# Altium schematic sheet Sensor_Glove_Main-X01.SchDoc: MCU + BLE
size Letter; Author: C. DEMOLDER; CompanyName: GTBID; DrawnBy: C. DEMOLDER; Engineer: C. DEMOLDER; Organization: GEORGIA TECH; Address1: NORTH AVE NW; Address2: ATLANTA, GA, 30332; DocumentNumber: P001; Revision: X01; SheetNumber: 1; SheetTotal: 4
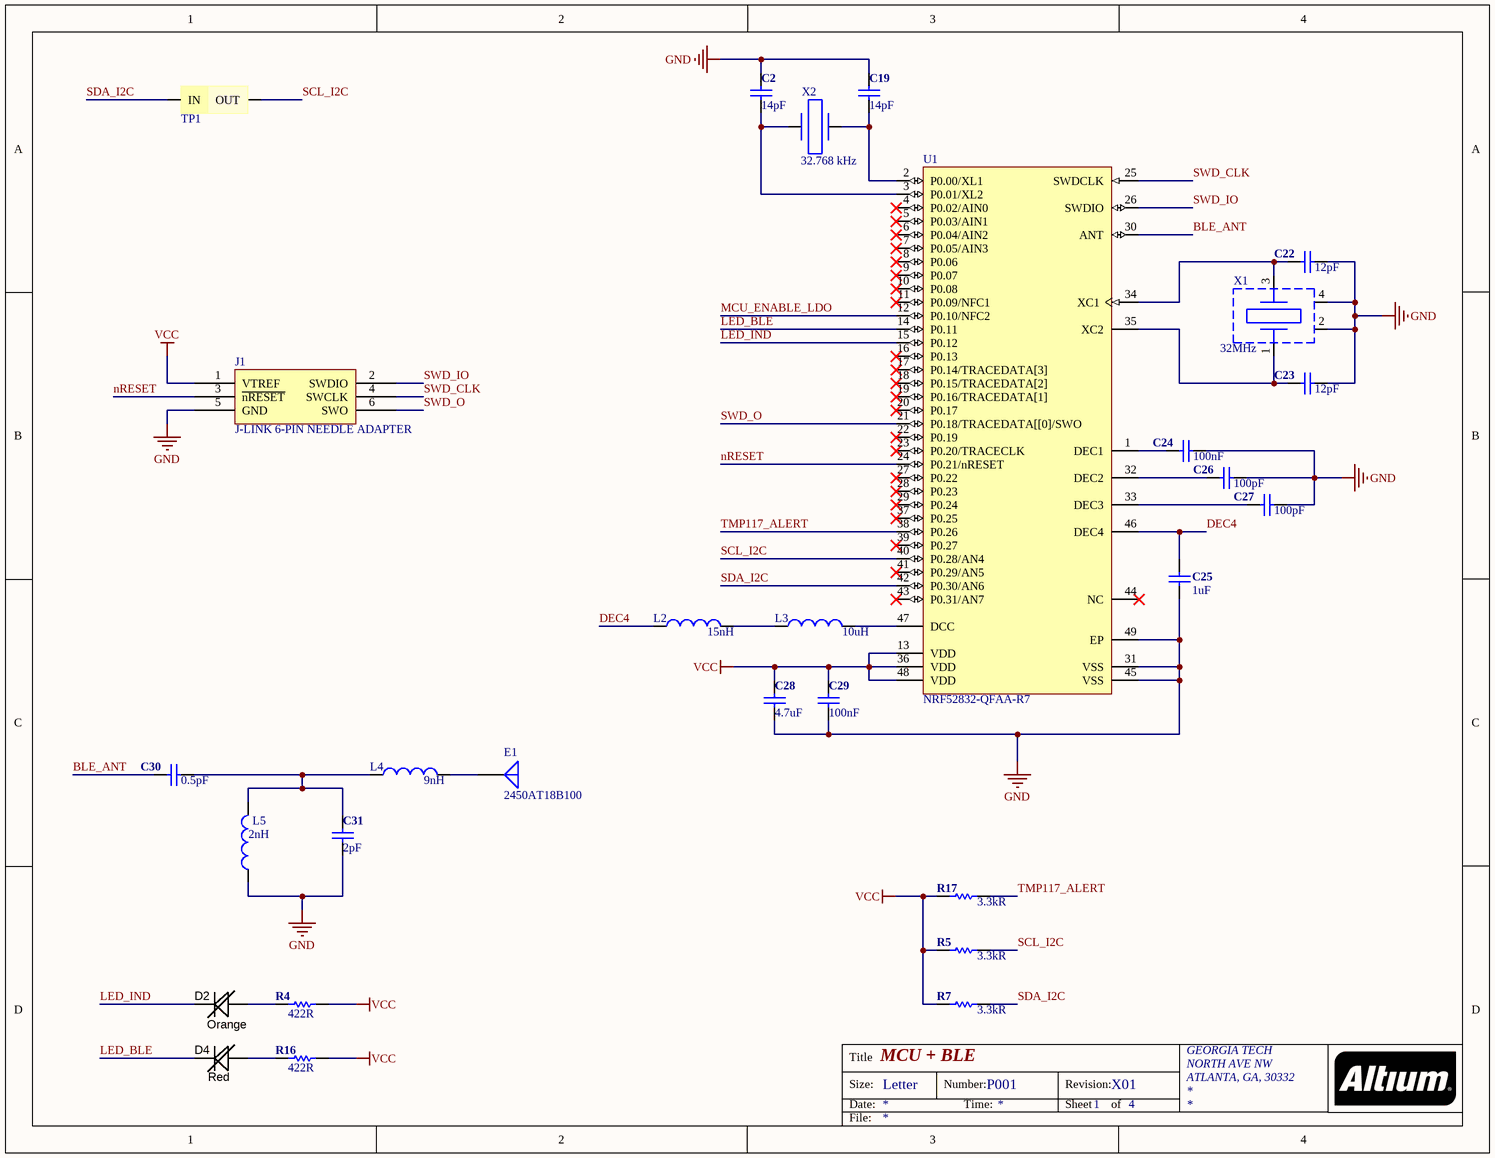
[diagram p0: Sensor_Glove_Main-X01.SchDoc]

## Parts
C2  14pF  [C0402]
C19  14pF  [C0402]
C22  12pF  [C0402]
C23  12pF  [C0402]
C24  100nF  [C0402]
C25  1uF  [C0402]
C26  100pF  [C0402]
C27  100pF  [C0402]
C28  4.7uF  [C0402]
C29  100nF  [C0402]
C30  0.5pF  [C0402]
C31  2pF  [C0402]
D2  Orange  [LED_0402]
D4  Red  [LED_0402]
E1  2450AT18B100  [2450AT18B100]
J1  J-LINK 6-PIN NEEDLE ADAPTER  [J-LINK 6 PIN NEEDLE]
L2  15nH  [L0402]
L3  10uH  [L0603]
L4  9nH  [L0402]
L5  2nH  [L0402]
R4  422R  [R0402]
R5  3.3kR  [R0402]
R7  3.3kR  [R0402]
R16  422R  [R0402]
R17  3.3kR  [R0402]
TP1  JUMPER  [JUMPER]  (value not drawn)
U1  NRF52832-QFAA-R7  [NRF52832-QFAA-R7]
X1  32MHz  [CRYSTAL_1MM6_X_1MM2]
X2  32.768 kHz  [CRYSTAL_1MM2_X_1MM0]

## Nets
GND: C2.1 C19.1 C22.2 C23.2 C24.2 C25.1 C26.2 C27.2 C28.2 C29.1 C31.2 J1.5(GND) L5.1 U1.31(VSS) U1.45(VSS) U1.49(EP) X1.2(GND) X1.4(GND)
VCC: C28.1 C29.2 J1.1(VTREF) R4.1 R5.1 R7.1 R16.1 R17.1 U1.13(VDD) U1.36(VDD) U1.48(VDD)
BLE_ANT: C30.1 U1.30(ANT)
DEC4: C25.2 L2.1 U1.46(DEC4)
LED_BLE: D4.K U1.14(P0.11)
LED_IND: D2.K U1.15(P0.12)
MCU_ENABLE_LDO: U1.12(P0.10/NFC2)
nRESET: J1.3(~{nRESET}) U1.24(P0.21/nRESET)
SCL_I2C: R5.2 TP1.2(OUT) U1.40(P0.28/AN4)
SDA_I2C: R7.2 TP1.1(IN) U1.42(P0.30/AN6)
SWD_CLK: J1.4(SWCLK) U1.25(SWDCLK)
SWD_IO: J1.2(SWDIO) U1.26(SWDIO)
SWD_O: J1.6(SWO) U1.21(P0.18/TRACEDATA[[0]/SWO)
TMP117_ALERT: R17.2 U1.38(P0.26)
NetC2_2: C2.2 U1.3(P0.01/XL2) X2.1
NetC19_2: C19.2 U1.2(P0.00/XL1) X2.2
NetC22_1: C22.1 U1.34(XC1) X1.3
NetC23_1: C23.1 U1.35(XC2) X1.1
NetC24_1: C24.1 U1.1(DEC1)
NetC26_1: C26.1 U1.32(DEC2)
NetC27_1: C27.1 U1.33(DEC3)
NetC30_2: C30.2 C31.1 L4.1 L5.2
NetD2_A: D2.A R4.2
NetD4_A: D4.A R16.2
NetE1_1: E1.1(A) L4.2
NetL2_2: L2.2 L3.1
NetL3_2: L3.2 U1.47(DCC)

Not connected (* = marked no-connect by the designer): U1 4(P0.02/AIN0)* 5(P0.03/AIN1)* 6(P0.04/AIN2)* 7(P0.05/AIN3)* 8(P0.06)* 9(P0.07)* 10(P0.08)* 11(P0.09/NFC1)* 16(P0.13)* 17(P0.14/TRACEDATA[3])* 18(P0.15/TRACEDATA[2])* 19(P0.16/TRACEDATA[1])* 20(P0.17)* 22(P0.19)* 23(P0.20/TRACECLK)* 27(P0.22)* 28(P0.23)* 29(P0.24)* 37(P0.25)* 39(P0.27)* 41(P0.29/AN5)* 43(P0.31/AN7)* 44(NC)*

## Notes on the sheet
- Title
- Size:
- Date:
- Letter
- Number:
- Time:
- Revision:
- Sheet
- of
- File:

## Library data of the parts
C2 C19 = C-0402(1005): Ceramic Capacitor, Multilayer, Ceramic, 50V, 1% +Tol, 1% -Tol, C0G, 30ppm/Cel TC, 0.000014uF, Surface Mount, 0402; Manufacturer: Kyocera AVX; Manufacturer Part Number: 04025U140FAT2A; ComponentLink1URL: https://datasheet.ciiva.com/169/product-169683.pdf; ComponentLink1Description: https://datasheet.ciiva.com/169/product-169683.pdf; Supplier 1: Digi-Key; Supplier Part Number 1: 478-10139-1-ND; RoHS: Yes; Category: Ceramic Capacitors; Stock 1: 25036; Pricing 1: 1=0.35000, 10=0.24100, 100=0.14460, 500=0.10846, 1000=0.09158, 2500=0.08676, 5000=0.08194 (USD); Mount: Surface Mount; Case/Package: 0402; Case Code (Imperial): 0402; Case Code (Metric): 1005; Min Operating Temperature: -55°C; Max Operating Temperature: 125°C; Dielectric: C0G; Capacitance: 14pF; Package Quantity: 10000; Voltage Rating: 50V; Voltage Rating (DC): 50V; Tolerance: 1%; Packaging: Tape and Reel; Termination: SMD/SMT; Composition: Ceramic; Length: 1mm; Width: 0.5mm; Thickness: 0.022inch; Depth: 0.5mm; Radiation Hardening: No; ComponentLink2URL: https://datasheet.ciiva.com:443/pdfs/VipMasterIC/IC/AVXC/AVXC-S-A0001948465/AVXC-S-A0001948465-1.pdf?src-supplier=IHS+Markit; ComponentLink2Description: https://datasheet.ciiva.com:443/pdfs/VipMasterIC/IC/AVXC/AVXC-S-A0001948465/AVXC-S-A0001948465-1.pdf?src-supplier=IHS+Markit; ComponentLink3URL: https://datasheet.ciiva.com/6269/useries-6269558.pdf?src-supplier=Digi-Key; ComponentLink3Description: https://datasheet.ciiva.com/6269/useries-6269558.pdf?src-supplier=Digi-Key; ComponentLink4URL: https://datasheet.ciiva.com/11568/useries-11568551.pdf?src-supplier=Avnet; ComponentLink4Description: https://datasheet.ciiva.com/11568/useries-11568551.pdf?src-supplier=Avnet
C22 C23 = C-0402(1005): Ceramic Capacitor, Multilayer, Ceramic, 50V, 1% +Tol, 1% -Tol, C0G, 30ppm/Cel TC, 0.000012uF, Surface Mount, 0402; Manufacturer: Kyocera AVX; Manufacturer Part Number: 04025U120FAT2A; ComponentLink1URL: https://datasheet.ciiva.com/169/product-169683.pdf; ComponentLink1Description: https://datasheet.ciiva.com/169/product-169683.pdf; Supplier 1: Digi-Key; Supplier Part Number 1: 478-10136-1-ND; RoHS: Yes; Category: Ceramic Capacitors; Stock 1: 30880; Pricing 1: 1=0.33000, 10=0.22700, 100=0.13630, 500=0.10220, 1000=0.08630, 2500=0.08176, 5000=0.07721 (USD); Mount: Surface Mount; Case/Package: 0402; Weight: 2.3E-05oz; Case Code (Metric): 1005; Case Code (Imperial): 0402; Min Operating Temperature: -55°C; Max Operating Temperature: 125°C; Termination: SMD/SMT; Composition: Ceramic; Tolerance: 1%; Packaging: Tape and Reel; Package Quantity: 10000; Capacitance: 12pF; Voltage Rating: 50V; Voltage Rating (DC): 50V; Dielectric: C0G; Length: 1mm; Height: 0.02mm; Thickness: 0.022inch; Depth: 0.5mm; Width: 0.02inch; Radiation Hardening: No; Lead Free: Lead Free; ComponentLink2URL: https://datasheet.ciiva.com:443/pdfs/VipMasterIC/IC/AVXC/AVXC-S-A0008668660/AVXC-S-A0008668660-1.pdf?src-supplier=IHS+Markit; ComponentLink2Description: https://datasheet.ciiva.com:443/pdfs/VipMasterIC/IC/AVXC/AVXC-S-A0008668660/AVXC-S-A0008668660-1.pdf?src-supplier=IHS+Markit; ComponentLink3URL: https://datasheet.ciiva.com/16327/useries-16327642.pdf?src-supplier=Future+Electronics; ComponentLink3Description: https://datasheet.ciiva.com/16327/useries-16327642.pdf?src-supplier=Future+Electronics; ComponentLink4URL: https://datasheet.ciiva.com/11568/useries-11568940.pdf?src-supplier=Avnet; ComponentLink4Description: https://datasheet.ciiva.com/11568/useries-11568940.pdf?src-supplier=Avnet
C24 C29 = C-0402(1005): Ceramic Capacitor, Multilayer, Ceramic, 25V, 10% +Tol, 10% -Tol, X5R, 15% TC, 0.1uF, Surface Mount, 0402; Manufacturer: Taiyo Yuden; Manufacturer Part Number: TMK105BJ104KV-F; ComponentLink1URL: https://datasheet.ciiva.com/169/product-169683.pdf; ComponentLink1Description: https://datasheet.ciiva.com/169/product-169683.pdf; Supplier 1: Digi-Key; Supplier Part Number 1: 587-1456-1-ND; RoHS: Yes; Category: Ceramic Capacitors; Mount: Surface Mount; Case/Package: 0402; Number of Pins: 2; Weight: 2.3E-05oz; Case Code (Imperial): 0402; Case Code (Metric): 1005; Min Operating Temperature: -55°C; Max Operating Temperature: 85°C; Capacitance: 100nF; Tolerance: 10%; Packaging: Tape and Reel; Dielectric: X5R; Voltage Rating (DC): 25V; Voltage Rating: 25V; Package Quantity: 1; Termination: SMD/SMT; Voltage: 25V; Length: 1mm; Height: 0.5mm; Width: 0.5mm; Depth: 0.5mm; Thickness: 0.022inch; REACH SVHC: No SVHC; Lead Free: Lead Free; Halogen Free: Halogen Free; ComponentLink2URL: https://datasheet.ciiva.com:443/pdfs/VipMasterIC/IC/TAIY/TAIY-S-A0009103435/TAIY-S-A0009103038-1.pdf?src-supplier=IHS+Markit; ComponentLink2Description: https://datasheet.ciiva.com:443/pdfs/VipMasterIC/IC/TAIY/TAIY-S-A0009103435/TAIY-S-A0009103038-1.pdf?src-supplier=IHS+Markit; ComponentLink3URL: https://datasheet.ciiva.com/30051/25tmk105bj104kv-f-30051094.pdf?src-supplier=Onlinecomponents.com; ComponentLink3Description: https://datasheet.ciiva.com/30051/25tmk105bj104kv-f-30051094.pdf?src-supplier=Onlinecomponents.com; ComponentLink4URL: https://datasheet.ciiva.com/15922/28tmk105bj104kv-f-15922315.pdf?src-supplier=Onlinecomponents.com; ComponentLink4Description: https://datasheet.ciiva.com/15922/28tmk105bj104kv-f-15922315.pdf?src-supplier=Onlinecomponents.com; ComponentLink5URL: https://datasheet.ciiva.com/131/tmk105bj104kv-f-ss-131420.pdf?src-supplier=Digi-Key; ComponentLink5Description: https://datasheet.ciiva.com/131/tmk105bj104kv-f-ss-131420.pdf?src-supplier=Digi-Key; ComponentLink6URL: https://datasheet.ciiva.com/22768/1693457-22768649.pdf?src-supplier=Farnell; ComponentLink6Description: https://datasheet.ciiva.com/22768/1693457-22768649.pdf?src-supplier=Farnell
  C24: Stock 1: 27456801; Pricing 1: 1=0.10000, 10=0.04600, 100=0.02050, 500=0.01464, 1000=0.01150, 2500=0.01045, 5000=0.00961 (USD); Composition: Ceramic
  C29: Stock 1: 21430567; Pricing 1: 1=0.10000, 10=0.04000, 50=0.02180, 100=0.01780, 500=0.01270, 1000=0.00998, 2500=0.00908, 5000=0.00835 (USD); Resistor Type: Ceramic
C25 = C-0402(1005): Ceramic Capacitor, Multilayer, Ceramic, 6.3V, 20% +Tol, 20% -Tol, X5R, 15% TC, 1uF, Surface Mount, 0402; Manufacturer: Yageo; Manufacturer Part Number: CC0402MRX5R5BB105; Dissipation Factor: 10%; ComponentLink1URL: https://datasheet.ciiva.com/169/product-169683.pdf; ComponentLink1Description: https://datasheet.ciiva.com/169/product-169683.pdf; Supplier 1: Digi-Key; Supplier Part Number 1: 311-1441-1-ND; RoHS: Yes; Category: Ceramic Capacitors; Stock 1: 16697; Pricing 1: 1=0.13000, 10=0.08900, 100=0.04200, 500=0.02946, 1000=0.02439, 2500=0.02270, 5000=0.02076 (USD); Mount: Surface Mount; Case/Package: 0402; Number of Pins: 2; Case Code (Imperial): 0402; Case Code (Metric): 1005; Min Operating Temperature: -55°C; Max Operating Temperature: 85°C; Capacitance: 1uF; Tolerance: 20%; Voltage Rating: 6.3V; Voltage Rating (DC): 6.3V; Packaging: Tape and Reel; Package Quantity: 1; Dielectric: X5R; Termination: SMD/SMT; Composition: Ceramic; Length: 1mm; Height: 0.5mm; Width: 0.5mm; Thickness: 0.022inch; Depth: 0.5mm; Lead Free: Lead Free; Halogen Free: Halogen Free; ComponentLink2URL: https://datasheet.ciiva.com:443/pdfs/VipMasterIC/IC/YAGO/YAGO-S-A0006851646/YAGO-S-A0006851646-1.pdf?src-supplier=IHS+Markit; ComponentLink2Description: https://datasheet.ciiva.com:443/pdfs/VipMasterIC/IC/YAGO/YAGO-S-A0006851646/YAGO-S-A0006851646-1.pdf?src-supplier=IHS+Markit; ComponentLink3URL: https://datasheet.ciiva.com/176/mlccorderingcode-176806.pdf?src-supplier=Digi-Key; ComponentLink3Description: https://datasheet.ciiva.com/176/mlccorderingcode-176806.pdf?src-supplier=Digi-Key; ComponentLink4URL: https://datasheet.ciiva.com/176/mlccorderingcode-176807.pdf?src-supplier=Digi-Key; ComponentLink4Description: https://datasheet.ciiva.com/176/mlccorderingcode-176807.pdf?src-supplier=Digi-Key; ComponentLink5URL: https://datasheet.ciiva.com/176/mlccorderingcode-176808.pdf?src-supplier=Digi-Key; ComponentLink5Description: https://datasheet.ciiva.com/176/mlccorderingcode-176808.pdf?src-supplier=Digi-Key
C26 C27 = C-0402(1005): Ceramic Capacitor, Multilayer, Ceramic, 50V, 1% +Tol, 1% -Tol, C0G, 30ppm/Cel TC, 0.0001uF, Surface Mount, 0402; Manufacturer: Yageo; Manufacturer Part Number: CC0402FRNPO9BN101; ComponentLink1URL: https://datasheet.ciiva.com/169/product-169683.pdf; ComponentLink1Description: https://datasheet.ciiva.com/169/product-169683.pdf; Supplier 1: Digi-Key; Supplier Part Number 1: 311-3329-1-ND; RoHS: Yes; Category: Ceramic Capacitors; Stock 1: 22812; Pricing 1: 1=0.11000, 10=0.08200, 100=0.03840, 500=0.02690, 1000=0.02228, 2500=0.02073, 5000=0.01897 (USD); Mount: Surface Mount; Case/Package: 0402; Case Code (Imperial): 0402; Case Code (Metric): 1005; Min Operating Temperature: -55°C; Max Operating Temperature: 125°C; Package Quantity: 10000; Voltage Rating (DC): 50V; Dielectric: C0G; Termination: SMD/SMT; Composition: Ceramic; Packaging: Tape and Reel; Capacitance: 100pF; Tolerance: 1%; Voltage Rating: 50V; Length: 1mm; Width: 0.02inch; Thickness: 0.022inch; Depth: 0.5mm; Lead Free: Lead Free; ComponentLink2URL: https://datasheet.ciiva.com:443/pdfs/VipMasterIC/IC/YAGO/YAGO-S-A0009251638/YAGO-S-A0009251638-1.pdf?src-supplier=IHS+Markit; ComponentLink2Description: https://datasheet.ciiva.com:443/pdfs/VipMasterIC/IC/YAGO/YAGO-S-A0009251638/YAGO-S-A0009251638-1.pdf?src-supplier=IHS+Markit; ComponentLink3URL: http://www.mouser.com/ds/2/447/Yageo_UPY-GP_NP0_16V-to-50V_9-358835.pdf?src-supplier=Mouser; ComponentLink3Description: http://www.mouser.com/ds/2/447/Yageo_UPY-GP_NP0_16V-to-50V_9-358835.pdf?src-supplier=Mouser; ComponentLink4URL: http://components.arrow.com/part/dataview/0323_00775990?src-supplier=Arrow+Europe; ComponentLink4Description: http://components.arrow.com/part/dataview/0323_00775990?src-supplier=Arrow+Europe; ComponentLink5URL: http://www.yageo.com/NewPortal/yageodocoutput?fileName=/pdf/MLCC/UPY-GP_NP0_16V-to-50V_14.pdf&src-supplier=Digi-Key; ComponentLink5Description: http://www.yageo.com/NewPortal/yageodocoutput?fileName=/pdf/MLCC/UPY-GP_NP0_16V-to-50V_14.pdf&src-supplier=Digi-Key; ComponentLink6URL: http://www.yageo.com/documents/recent/UPY-GP_NP0_16V-to-50V_16.pdf?src-supplier=Digi-Key; ComponentLink6Description: http://www.yageo.com/documents/recent/UPY-GP_NP0_16V-to-50V_16.pdf?src-supplier=Digi-Key; ComponentLink7URL: http://www.yageo.com/documents/recent/UPY-GP_NP0_16V-to-50V_9.pdf?src-supplier=Future+Electronics; ComponentLink7Description: http://www.yageo.com/documents/recent/UPY-GP_NP0_16V-to-50V_9.pdf?src-supplier=Future+Electronics
C28 = C-0402(1005): 0402 10 V 4.7 uF ±20% Tolerance X5R Multilayer Ceramic Chip Capacitor; Manufacturer: Murata; Manufacturer Part Number: GRM155R61A475MEAAD; Voltage Rating: 10V; ComponentLink1URL: https://datasheet.ciiva.com/169/product-169683.pdf; ComponentLink1Description: https://datasheet.ciiva.com/169/product-169683.pdf; Supplier 1: Digi-Key; Supplier Part Number 1: 490-14306-1-ND; Category: Ceramic Capacitors; Stock 1: 420733; Pricing 1: 1=0.25000, 10=0.16900, 100=0.08560, 500=0.05854, 1000=0.05179, 2500=0.04954, 5000=0.04503 (USD); Mount: Surface Mount; Case/Package: 0402; Case Code (Imperial): 0402; Case Code (Metric): 1005; Min Operating Temperature: -55°C; Max Operating Temperature: 85°C; Packaging: Tape and Reel; Capacitance: 4.7uF; Tolerance: 20%; ComponentLink2URL: https://psearch.en.murata.com:443/capacitor/product/GRM155R61A475MEAA%23.pdf?src-supplier=IHS+Markit; ComponentLink2Description: https://psearch.en.murata.com:443/capacitor/product/GRM155R61A475MEAA%23.pdf?src-supplier=IHS+Markit; ComponentLink3URL: http://www.farnell.com/datasheets/2189109.pdf?src-supplier=Farnell; ComponentLink3Description: http://www.farnell.com/datasheets/2189109.pdf?src-supplier=Farnell; ComponentLink4URL: https://search.murata.co.jp/Ceramy/image/img/A01X/G101/ENG/GRM155R61A475MEAA-01.pdf?src-supplier=Digi-Key; ComponentLink4Description: https://search.murata.co.jp/Ceramy/image/img/A01X/G101/ENG/GRM155R61A475MEAA-01.pdf?src-supplier=Digi-Key; ComponentLink5URL: http://www.farnell.com/datasheets/2189109.pdf?src-supplier=Element14; ComponentLink5Description: http://www.farnell.com/datasheets/2189109.pdf?src-supplier=Element14; ComponentLink6URL: http://www.farnell.com/datasheets/2189109.pdf?src-supplier=Newark; ComponentLink6Description: http://www.farnell.com/datasheets/2189109.pdf?src-supplier=Newark; ComponentLink7URL: http://datasheet.octopart.com/GRM155R61A475MEAAD-Murata-datasheet-138740730.pdf?src-supplier=Ciiva+Crawler; ComponentLink7Description: http://datasheet.octopart.com/GRM155R61A475MEAAD-Murata-datasheet-138740730.pdf?src-supplier=Ciiva+Crawler; ComponentLink8URL: http://datasheet.octopart.com/GRM155R61A475MEAAD-Murata-datasheet-140690084.pdf?src-supplier=Ciiva+Crawler; ComponentLink8Description: http://datasheet.octopart.com/GRM155R61A475MEAAD-Murata-datasheet-140690084.pdf?src-supplier=Ciiva+Crawler; ComponentLink9URL: http://datasheet.octopart.com/GRM155R61A475MEAAD-Murata-datasheet-68589269.pdf?src-supplier=Newark; ComponentLink9Description: http://datasheet.octopart.com/GRM155R61A475MEAAD-Murata-datasheet-68589269.pdf?src-supplier=Newark; ComponentLink10URL: http://datasheet.octopart.com/GRM155R61A475MEAAD-Murata-datasheet-8819587.pdf; ComponentLink10Description: http://datasheet.octopart.com/GRM155R61A475MEAAD-Murata-datasheet-8819587.pdf; ComponentLink11URL: http://datasheet.octopart.com/GRM155R61A475MEAAD-Murata-datasheet-10025737.pdf; ComponentLink11Description: http://datasheet.octopart.com/GRM155R61A475MEAAD-Murata-datasheet-10025737.pdf; ComponentLink12URL: http://datasheet.octopart.com/GRM155R61A475MEAAD-Murata-datasheet-11978611.pdf; ComponentLink12Description: http://datasheet.octopart.com/GRM155R61A475MEAAD-Murata-datasheet-11978611.pdf; ComponentLink13URL: http://datasheet.octopart.com/GRM155R61A475MEAAD-Murata-datasheet-12510076.pdf; ComponentLink13Description: http://datasheet.octopart.com/GRM155R61A475MEAAD-Murata-datasheet-12510076.pdf; ComponentLink14URL: http://datasheet.octopart.com/GRM155R61A475MEAAD-Murata-datasheet-12515295.pdf; ComponentLink14Description: http://datasheet.octopart.com/GRM155R61A475MEAAD-Murata-datasheet-12515295.pdf
C30 = C-0402(1005): Ceramic Capacitor, Multilayer, Ceramic, 50V, 10% +Tol, 10% -Tol, C0G, 30ppm/Cel TC, 0.0000005uF, Surface Mount, 0402; Manufacturer: Murata; Manufacturer Part Number: GJM1555C1HR50WB01D; ComponentLink1URL: https://datasheet.ciiva.com/169/product-169683.pdf; ComponentLink1Description: https://datasheet.ciiva.com/169/product-169683.pdf; Supplier 1: Digi-Key; Supplier Part Number 1: 490-11250-1-ND; RoHS: Yes; Category: Ceramic Capacitors; Stock 1: 75988; Pricing 1: 1=0.30000, 10=0.20500, 100=0.11610, 500=0.08198, 1000=0.07173, 2500=0.06831, 5000=0.06319 (USD); Mount: Surface Mount; Case/Package: 0402; Case Code (Metric): 1005; Case Code (Imperial): 0402; Min Operating Temperature: -55°C; Max Operating Temperature: 125°C; Package Quantity: 10000; Capacitance: 0.5pF; Voltage Rating: 50V; Packaging: Tape and Reel; Voltage Rating (DC): 50V; Dielectric: C0G; Termination: SMD/SMT; Voltage: 50V; Length: 1mm; Height: 0.5mm; Width: 0.02inch; Thickness: 0.022inch; Depth: 0.5mm; Radiation Hardening: No; Lead Free: Lead Free; ComponentLink2URL: https://datasheet.ciiva.com:443/pdfs/VipMasterIC/IC/MURE/MURE-S-A0004378008/MURE-S-A0004383131-1.pdf?src-supplier=IHS+Markit; ComponentLink2Description: https://datasheet.ciiva.com:443/pdfs/VipMasterIC/IC/MURE/MURE-S-A0004378008/MURE-S-A0004383131-1.pdf?src-supplier=IHS+Markit; ComponentLink3URL: https://datasheet.ciiva.com/169/product-169683.pdf?src-supplier=Digi-Key; ComponentLink3Description: https://datasheet.ciiva.com/169/product-169683.pdf?src-supplier=Digi-Key
C31 = C-0402(1005): Ceramic Capacitor, Multilayer, Ceramic, 50V, 5% +Tol, 5% -Tol, C0G, 30ppm/Cel TC, 0.000002uF, Surface Mount, 0402; Manufacturer: Murata; Manufacturer Part Number: GJM1555C1H2R0BB01D; ComponentLink1URL: https://datasheet.ciiva.com/169/product-169683.pdf; ComponentLink1Description: https://datasheet.ciiva.com/169/product-169683.pdf; Supplier 1: Digi-Key; Supplier Part Number 1: 490-8091-1-ND; RoHS: Yes; Category: Ceramic Capacitors; Stock 1: 969; Pricing 1: 1=0.19000, 10=0.13000, 100=0.06590, 500=0.04508, 1000=0.03987, 2500=0.03814, 5000=0.03467 (USD); Mount: Surface Mount; Case/Package: 0402; Number of Pins: 2; Case Code (Metric): 1005; Case Code (Imperial): 0402; Min Operating Temperature: -55°C; Max Operating Temperature: 125°C; Package Quantity: 1; Packaging: Tape and Reel; Capacitance: 2pF; Voltage Rating: 50V; Voltage Rating (DC): 50V; Dielectric: C0G; Termination: SMD/SMT; Length: 1mm; Height: 0.5mm; Width: 0.5mm; Thickness: 0.022inch; Lead Pitch: 0.3mm; Depth: 0.5mm; Radiation Hardening: No; REACH SVHC: No SVHC; Lead Free: Lead Free; ComponentLink2URL: https://datasheet.ciiva.com:443/pdfs/VipMasterIC/IC/MURE/MURE-S-A0008911154/MURE-S-A0008911197-1.pdf?src-supplier=IHS+Markit; ComponentLink2Description: https://datasheet.ciiva.com:443/pdfs/VipMasterIC/IC/MURE/MURE-S-A0008911154/MURE-S-A0008911197-1.pdf?src-supplier=IHS+Markit; ComponentLink3URL: https://datasheet.ciiva.com/5694/1700193-5694978.pdf?src-supplier=Farnell; ComponentLink3Description: https://datasheet.ciiva.com/5694/1700193-5694978.pdf?src-supplier=Farnell; ComponentLink4URL: https://datasheet.ciiva.com/17453/product-17453487.pdf?src-supplier=Avnet+Europe; ComponentLink4Description: https://datasheet.ciiva.com/17453/product-17453487.pdf?src-supplier=Avnet+Europe; ComponentLink5URL: https://datasheet.ciiva.com/16440/l0005e-16440476.pdf?src-supplier=Future+Electronics; ComponentLink5Description: https://datasheet.ciiva.com/16440/l0005e-16440476.pdf?src-supplier=Future+Electronics
D2 = LED_0402(1005): Single Color LED, Super Bright Orange, Water Clear, 0.8mm; Manufacturer: Kingbright; Manufacturer Part Number: APHHS1005SECK; Number of LEDs: 1; Dominant Wavelength: 601nm; Test Current: 20mA; Viewing Angle: 120°; Lens Style: Clear,Flat; Luminous Intensity: 240mcd; Forward Voltage: 2.1V; Supplier 1: Digi-Key; Supplier Part Number 1: 754-1103-1-ND; RoHS: Yes; Category: LEDs; Stock 1: 18062; Pricing 1: 1=0.50000, 10=0.35400, 100=0.20650, 500=0.14160, 1000=0.11800 (USD); Mount: Surface Mount; Case/Package: 0402; Number of Pins: 2; Lens Color: Clear; Color: Orange; Case Code (Imperial): 0402; Case Code (Metric): 1005; Min Operating Temperature: -40°C; Max Operating Temperature: 85°C; Package Quantity: 2000; Packaging: Tape and Reel; Wavelength: 601nm; Illumination Color: Orange; Forward Current: 20mA; Length: 1mm; Height: 0.6mm; Width: 0.5mm; Lead Free: Lead Free; ComponentLink1URL: https://datasheet.ciiva.com:443/pdfs/VipMasterIC/IC/KNGB/KNGBS06640/KNGBS06640-1.pdf?src-supplier=IHS+Markit; ComponentLink1Description: https://datasheet.ciiva.com:443/pdfs/VipMasterIC/IC/KNGB/KNGBS06640/KNGBS06640-1.pdf?src-supplier=IHS+Markit; ComponentLink2URL: https://datasheet.ciiva.com/2114/aphhs1005seck-2114149.pdf?src-supplier=Digi-Key; ComponentLink2Description: https://datasheet.ciiva.com/2114/aphhs1005seck-2114149.pdf?src-supplier=Digi-Key; ComponentLink3URL: https://datasheet.ciiva.com/4688/aphhs1005seck-36485-4688716.pdf?src-supplier=Mouser; ComponentLink3Description: https://datasheet.ciiva.com/4688/aphhs1005seck-36485-4688716.pdf?src-supplier=Mouser; ComponentLink4URL: https://datasheet.ciiva.com/2114/aphhs1005seck-2114150.pdf?src-supplier=Digi-Key; ComponentLink4Description: https://datasheet.ciiva.com/2114/aphhs1005seck-2114150.pdf?src-supplier=Digi-Key; ComponentLink5URL: https://datasheet.ciiva.com/2114/aphhs1005seck-2114151.pdf?src-supplier=Digi-Key; ComponentLink5Description: https://datasheet.ciiva.com/2114/aphhs1005seck-2114151.pdf?src-supplier=Digi-Key; ComponentLink6URL: https://datasheet.ciiva.com/16412/aphhs1005seck-16412186.pdf?src-supplier=Future+Electronics; ComponentLink6Description: https://datasheet.ciiva.com/16412/aphhs1005seck-16412186.pdf?src-supplier=Future+Electronics
D4 = LED_0402(1005): Single Color LED, Hyper Red, Water Clear, 0.8mm; Manufacturer: Kingbright; Manufacturer Part Number: APHHS1005SURCK; Forward Current: 20mA; Forward Voltage: 1.95V; Luminous Intensity: 220mcd; Viewing Angle: 120°; Wavelength: 635nm; Lens Style: Clear,Flat; Dominant Wavelength: 630nm; Number of LEDs: 1; Supplier 1: Digi-Key; Supplier Part Number 1: 754-1104-1-ND; RoHS: Yes; Category: LEDs; Stock 1: 12156; Pricing 1: 1=0.50000, 10=0.35400, 100=0.20650, 500=0.14160, 1000=0.11800 (USD); Mount: Surface Mount; Case/Package: 0402; Number of Pins: 2; Color: Red; Case Code (Metric): 1005; Case Code (Imperial): 0402; Lens Color: Clear; Min Operating Temperature: -40°C; Max Operating Temperature: 85°C; Packaging: Tape and Reel; Package Quantity: 2000; Illumination Color: Red; Test Current: 20mA; Length: 1mm; Height: 0.6mm; Width: 0.5mm; Lead Free: Lead Free; ComponentLink1URL: https://datasheet.ciiva.com:443/pdfs/VipMasterIC/IC/KBEC/KBEC-S-A0008947180/KBEC-S-A0008958151-1.pdf?src-supplier=IHS+Markit; ComponentLink1Description: https://datasheet.ciiva.com:443/pdfs/VipMasterIC/IC/KBEC/KBEC-S-A0008947180/KBEC-S-A0008958151-1.pdf?src-supplier=IHS+Markit; ComponentLink2URL: https://datasheet.ciiva.com/4689/aphhs1005surck-32322-4689068.pdf?src-supplier=Mouser; ComponentLink2Description: https://datasheet.ciiva.com/4689/aphhs1005surck-32322-4689068.pdf?src-supplier=Mouser; ComponentLink3URL: https://datasheet.ciiva.com/2114/aphhs1005surck-2114140.pdf?src-supplier=Digi-Key; ComponentLink3Description: https://datasheet.ciiva.com/2114/aphhs1005surck-2114140.pdf?src-supplier=Digi-Key; ComponentLink4URL: https://datasheet.ciiva.com/14603/70062833-14603899.pdf?src-supplier=Allied+Electronics; ComponentLink4Description: https://datasheet.ciiva.com/14603/70062833-14603899.pdf?src-supplier=Allied+Electronics; ComponentLink5URL: https://datasheet.ciiva.com/2114/aphhs1005surck-2114142.pdf?src-supplier=Digi-Key; ComponentLink5Description: https://datasheet.ciiva.com/2114/aphhs1005surck-2114142.pdf?src-supplier=Digi-Key; ComponentLink6URL: https://datasheet.ciiva.com/2114/aphhs1005surck-2114141.pdf?src-supplier=Digi-Key; ComponentLink6Description: https://datasheet.ciiva.com/2114/aphhs1005surck-2114141.pdf?src-supplier=Digi-Key
E1 = 2450AT18B100: 2.4 GHz BLE Antenna; Manufacturer: Johanson; Manufacturer Part Number: 2450AT18B100E; Description 1: JOHANSON TECHNOLOGY         2450AT18B100E             ANTENNA, CERAMIC, 2.45GHZ; Impedance: 50R; Bandwidth: 100MHz; Power Rating: 3W; Frequency: 2.45GHz; Number of Bands: 1; Return Loss: -9.5dB; Max Frequency: 2.5GHz; Gain: -0.5dB; Supplier 1: Digi-Key; Supplier Part Number 1: 712-1006-1-ND; Stock 1: 187598; Pricing 1: 1=0.62, 10=0.541, 25=0.4788, 100=0.4172, 250=0.3631, 500=0.309, 1000=0.2472 (USD); Mount: Surface Mount; Case/Package: CSMD; Contact Plating: Tin; Packaging: Tape and Reel; Package Quantity: 1; Max Power Dissipation: 3W; Termination: Solder; Length: 3.2mm; Height: 0.051inch; Width: 1.6mm; REACH SVHC: No SVHC; ComponentLink1URL: https://datasheet.ciiva.com/1124/1318299-1124918.pdf; ComponentLink1Description: https://datasheet.ciiva.com/1124/1318299-1124918.pdf; ComponentLink2URL: https://datasheet.ciiva.com/24025/antenna-2450at18b100-242422-24025839.pdf; ComponentLink2Description: https://datasheet.ciiva.com/24025/antenna-2450at18b100-242422-24025839.pdf
J1 = J-Link 6 pin needle: Manufacturer: Segger; Manufacturer Part Number: 8.06.16 J-LINK 6-PIN NEEDLE ADAPTER; Supplier 1: Digi-Key; RoHS: No; Stock 1: 177; Pricing 1: 1=104.13000 (USD); Supplier Part Number 1: 899-1051-ND
L2 = I-0402(1005): General Purpose Inductor, 0.015uH, 5%, 1 Element, Ferrite-Core, SMD, 0402; Manufacturer: Taiyo Yuden; Manufacturer Part Number: HK100515NJ-T; Core Material: Ferrite,Ceramic; Body Material: Ceramic; Current Rating: 320mA; Shielding: Unshielded; Self Resonant Frequency: 2.3GHz; Q Factor: 8; DC Resistance (DCR): 460mR; Test Frequency: 100MHz; Max DC Current: 300mA; Supplier 1: Digi-Key; Supplier Part Number 1: 587-1521-1-ND; RoHS: Yes; Category: Fixed Inductors; Stock 1: 127125; Pricing 1: 1=0.10000, 10=0.02900, 100=0.01960, 500=0.01582, 1000=0.01351, 2500=0.01208 (USD); Mount: Surface Mount; Case/Package: 0402; Number of Pins: 2; Case Code (Metric): 1005; Case Code (Imperial): 0402; Min Operating Temperature: -55°C; Max Operating Temperature: 125°C; Packaging: Tape and Reel; Inductance: 15nH; Package Quantity: 10000; Tolerance: 5%; Inductance Tolerance: 5%; Termination: SMD/SMT; DC Current: 320mA; Military Standard: Not; Length: 1.05mm; Height: 0.5mm; Width: 0.02inch; Height - Seated (Max): 0.022inch; Depth: 0.55mm; Radiation Hardening: No; Lead Free: Exempt; Halogen Free: Halogen Free; REACH SVHC: Unknown; ComponentLink1URL: https://datasheet.ciiva.com:443/pdfs/VipMasterIC/IC/TAIY/TAIY-S-A0009098652/TAIY-S-A0009098648-1.pdf?src-supplier=IHS+Markit; ComponentLink1Description: https://datasheet.ciiva.com:443/pdfs/VipMasterIC/IC/TAIY/TAIY-S-A0009098652/TAIY-S-A0009098648-1.pdf?src-supplier=IHS+Markit; ComponentLink2URL: https://datasheet.ciiva.com/6688/hk100515nj-t-ss-6688640.pdf?src-supplier=Digi-Key; ComponentLink2Description: https://datasheet.ciiva.com/6688/hk100515nj-t-ss-6688640.pdf?src-supplier=Digi-Key; ComponentLink3URL: https://datasheet.ciiva.com/8498/hk100515nj-t-ss-8498917.pdf?src-supplier=Avnet; ComponentLink3Description: https://datasheet.ciiva.com/8498/hk100515nj-t-ss-8498917.pdf?src-supplier=Avnet; ComponentLink4URL: https://datasheet.ciiva.com/26871/getdatasheetpartid-645793-26871605.pdf?src-supplier=Verical; ComponentLink4Description: https://datasheet.ciiva.com/26871/getdatasheetpartid-645793-26871605.pdf?src-supplier=Verical; ComponentLink5URL: https://datasheet.ciiva.com/15986/1443hk100515nj-t-15986294.pdf?src-supplier=Onlinecomponents.com; ComponentLink5Description: https://datasheet.ciiva.com/15986/1443hk100515nj-t-15986294.pdf?src-supplier=Onlinecomponents.com; ComponentLink6URL: https://datasheet.ciiva.com/30215/1387hk100515nj-t-30215366.pdf?src-supplier=Onlinecomponents.com; ComponentLink6Description: https://datasheet.ciiva.com/30215/1387hk100515nj-t-30215366.pdf?src-supplier=Onlinecomponents.com
L3 = I-0603(1608): General Purpose Inductor, 10uH, 10%, 1 Element, Ferrite-Core, SMD, 0603; Manufacturer: Taiyo Yuden; Manufacturer Part Number: CBMF1608T100K; DC Resistance (DCR): 468mR; Test Frequency: 2.52MHz; Max DC Current: 380mA; Saturation Current: 115mA; Shielding: Unshielded; Self Resonant Frequency: 32MHz; Supplier 1: Digi-Key; Supplier Part Number 1: 587-1720-1-ND; RoHS: Yes; Category: Fixed Inductors; Stock 1: 148191; Pricing 1: 1=0.27000, 10=0.23900, 100=0.16450, 500=0.14054, 1000=0.10764 (USD); Mount: Surface Mount; Case/Package: 0603; Core Material: Ferrite; Case Code (Metric): 1608; Case Code (Imperial): 0603; Min Operating Temperature: -40°C; Max Operating Temperature: 105°C; Composition: Wirewound; Inductance: 10uH; Termination: SMD/SMT; DC Current: 380mA; Military Standard: Not; Package Quantity: 3000; Current Rating: 380mA; Tolerance: 10%; Packaging: Tape and Reel; Inductance Tolerance: 10%; Length: 0.063inch; Height: 0.8mm; Height - Seated (Max): 0.039inch; Depth: 1mm; Width: 0.031inch; Radiation Hardening: No; REACH SVHC: Unknown; Lead Free: Lead Free; Halogen Free: Halogen Free; ComponentLink1URL: https://datasheet.ciiva.com:443/pdfs/VipMasterIC/IC/TAIY/TAIY-S-A0009098652/TAIY-S-A0009097792-1.pdf?src-supplier=IHS+Markit; ComponentLink1Description: https://datasheet.ciiva.com:443/pdfs/VipMasterIC/IC/TAIY/TAIY-S-A0009098652/TAIY-S-A0009097792-1.pdf?src-supplier=IHS+Markit; ComponentLink2URL: https://datasheet.ciiva.com/1040/cbmf1608t100k-ss-1040608.pdf?src-supplier=Digi-Key; ComponentLink2Description: https://datasheet.ciiva.com/1040/cbmf1608t100k-ss-1040608.pdf?src-supplier=Digi-Key; ComponentLink3URL: https://datasheet.ciiva.com/26871/getdatasheetpartid-638595-26871191.pdf?src-supplier=Verical; ComponentLink3Description: https://datasheet.ciiva.com/26871/getdatasheetpartid-638595-26871191.pdf?src-supplier=Verical; ComponentLink4URL: https://datasheet.ciiva.com/15981/521cbmf1608t100k-15981672.pdf?src-supplier=Onlinecomponents.com; ComponentLink4Description: https://datasheet.ciiva.com/15981/521cbmf1608t100k-15981672.pdf?src-supplier=Onlinecomponents.com; ComponentLink5URL: https://datasheet.ciiva.com/46395/1521599-46395181.pdf?src-supplier=Element14; ComponentLink5Description: https://datasheet.ciiva.com/46395/1521599-46395181.pdf?src-supplier=Element14
L4 = I-0402(1005): General Purpose Inductor, 0.009uH, 2%, 1 Element, SMD; Manufacturer: Murata; Manufacturer Part Number: LQW15AN9N0G80D; Current Rating: 1.42A; Shielding: Unshielded; DC Resistance (DCR): 70mR; Self Resonant Frequency: 6.5GHz; Test Frequency: 100MHz; Supplier 1: Digi-Key; Supplier Part Number 1: 490-14715-1-ND; RoHS: Yes; Category: Fixed Inductors; Stock 1: 10351; Pricing 1: 1=0.25000, 10=0.22100, 100=0.15180, 500=0.12972, 1000=0.09936, 2500=0.09384 (USD); Mount: Surface Mount; Case/Package: 0402; Min Operating Temperature: -55°C; Max Operating Temperature: 125°C; Tolerance: 2%; Packaging: Tape and Reel; Composition: Wirewound; Inductance: 9nH; Length: 0.039inch; Width: 0.024inch; Height - Seated (Max): 0.024inch; ComponentLink1URL: https://datasheet.ciiva.com:443/pdfs/VipMasterIC/IC/MURE/MURE-S-A0004390746/MURE-S-A0004390720-1.pdf?src-supplier=IHS+Markit; ComponentLink1Description: https://datasheet.ciiva.com:443/pdfs/VipMasterIC/IC/MURE/MURE-S-A0004390746/MURE-S-A0004390720-1.pdf?src-supplier=IHS+Markit; ComponentLink2URL: https://search.murata.co.jp/Ceramy/image/img/P02/partnumbering_LQ3E.pdf?src-supplier=Digi-Key; ComponentLink2Description: https://search.murata.co.jp/Ceramy/image/img/P02/partnumbering_LQ3E.pdf?src-supplier=Digi-Key; ComponentLink3URL: https://search.murata.co.jp/Ceramy/image/img/P02/JELF243A-0100.pdf?src-supplier=Digi-Key; ComponentLink3Description: https://search.murata.co.jp/Ceramy/image/img/P02/JELF243A-0100.pdf?src-supplier=Digi-Key
L5 = I-0402(1005): General Purpose Inductor, 0.002uH, 5%, 1 Element, Ceramic-Core, SMD, 0402; Manufacturer: Abracon; Manufacturer Part Number: AISC-0402-2N0J-T; DC Resistance (DCR): 70mR; Test Frequency: 250MHz; Max DC Current: 1.04A; Shielding: Unshielded; Q Factor: 16; Self Resonant Frequency: 11.1GHz; Supplier 1: Digi-Key; Supplier Part Number 1: 535-10424-1-ND; RoHS: Yes; Category: Inductors; Stock 1: 4311; Pricing 1: 1=0.34000, 10=0.30400, 100=0.20870, 500=0.17836, 1000=0.13662, 2500=0.12903 (USD); Mount: Surface Mount; Case/Package: 0402; Number of Pins: 2; Case Code (Metric): 1005; Case Code (Imperial): 0402; Core Material: Ceramic; Min Operating Temperature: -40°C; Max Operating Temperature: 125°C; Composition: Wirewound,Ceramic; Inductance: 2nH; Termination: SMD/SMT; DC Current: 1.04A; Military Standard: Not; Package Quantity: 10000; Current Rating: 1.04A; Tolerance: 5%; Packaging: Tape and Reel; Length: 1.19mm; Height: 0.66mm; Height - Seated (Max): 0.026inch; Depth: 0.64mm; Width: 0.025inch; Radiation Hardening: No; ComponentLink1URL: https://datasheet.ciiva.com:443/pdfs/VipMasterIC/IC/ABRC/ABRC-S-A0009700385/ABRC-S-A0009751294-1.pdf?src-supplier=IHS+Markit; ComponentLink1Description: https://datasheet.ciiva.com:443/pdfs/VipMasterIC/IC/ABRC/ABRC-S-A0009700385/ABRC-S-A0009751294-1.pdf?src-supplier=IHS+Markit; ComponentLink2URL: https://datasheet.ciiva.com/26928/getdatasheetpartid-762366-26928064.pdf?src-supplier=Verical; ComponentLink2Description: https://datasheet.ciiva.com/26928/getdatasheetpartid-762366-26928064.pdf?src-supplier=Verical; ComponentLink3URL: https://datasheet.ciiva.com/11140/aisc-0402-11140262.pdf?src-supplier=Avnet; ComponentLink3Description: https://datasheet.ciiva.com/11140/aisc-0402-11140262.pdf?src-supplier=Avnet; ComponentLink4URL: https://datasheet.ciiva.com/1054/aisc-0402-1054030.pdf?src-supplier=Digi-Key; ComponentLink4Description: https://datasheet.ciiva.com/1054/aisc-0402-1054030.pdf?src-supplier=Digi-Key; ComponentLink5URL: https://datasheet.ciiva.com/1054/aisc-0402-1054031.pdf?src-supplier=Digi-Key; ComponentLink5Description: https://datasheet.ciiva.com/1054/aisc-0402-1054031.pdf?src-supplier=Digi-Key; ComponentLink6URL: https://datasheet.ciiva.com/1054/aisc-0402-1054032.pdf?src-supplier=Digi-Key; ComponentLink6Description: https://datasheet.ciiva.com/1054/aisc-0402-1054032.pdf?src-supplier=Digi-Key
R4 R16 = R-0402(1005): Fixed Resistor, Thin Film, 0.0625W, 422ohm, 50V, 0.1% +/-Tol, 25ppm/Cel, Surface Mount, 0402; Manufacturer: Yageo; Manufacturer Part Number: RT0402BRD07422RL; Power Rating: 62.5mW; Temperature Coefficient: 25ppm/°C; Supplier 1: Digi-Key; Supplier Part Number 1: YAG4263CT-ND; RoHS: Yes; Category: Chip SMD Resistors; Stock 1: 9302; Pricing 1: 1=0.39000, 10=0.27800, 100=0.11140, 1000=0.05488, 2500=0.05084, 5000=0.04600 (USD); Case/Package: 0402; Case Code (Metric): 1005; Case Code (Imperial): 0402; Min Operating Temperature: -55°C; Max Operating Temperature: 125°C; Voltage Rating: 50V; Resistance: 422R; Tolerance: 0.1%; Packaging: Tape and Reel; Termination: SMD/SMT; Voltage Rating (DC): 50V; Length: 1mm; Height: 350um; Width: 500um; Lead Free: Lead Free; ComponentLink1URL: https://datasheet.ciiva.com:443/pdfs/VipMasterIC/IC/YAGO/YAGO-S-A0008510989/YAGO-S-A0008510989-1.pdf?src-supplier=IHS+Markit; ComponentLink1Description: https://datasheet.ciiva.com:443/pdfs/VipMasterIC/IC/YAGO/YAGO-S-A0008510989/YAGO-S-A0008510989-1.pdf?src-supplier=IHS+Markit; ComponentLink2URL: https://datasheet.ciiva.com/12705/pyu-rt-1-to-0-05-rohs-l-4-12705867.pdf?src-supplier=Mouser; ComponentLink2Description: https://datasheet.ciiva.com/12705/pyu-rt-1-to-0-05-rohs-l-4-12705867.pdf?src-supplier=Mouser
R5 R7 R17 = R-0402(1005): Fixed Resistor, Metal Glaze/thick Film, 0.0625W, 3300ohm, 50V, 1% +/-Tol, 100ppm/Cel, Surface Mount, 0402; Manufacturer: Yageo; Manufacturer Part Number: AC0402FR-073K3L; Power Rating: 62.5mW; Max Power Dissipation: 63mW; Temperature Coefficient: 100ppm/°C; Supplier 1: Digi-Key; Supplier Part Number 1: YAG3483CT-ND; RoHS: Yes; Category: Chip SMD Resistors; Pricing 1: 1=0.10000, 10=0.02100, 100=0.00870, 1000=0.00390, 2500=0.00338, 5000=0.00279 (USD); Case/Package: 0402; Case Code (Imperial): 0402; Case Code (Metric): 1005; Min Operating Temperature: -55°C; Max Operating Temperature: 155°C; Tolerance: 1%; Packaging: Tape and Reel; Resistance: 3.3kR; Voltage Rating: 50V; Composition: Thick Film; Number of Terminations: 2; Termination: SMD/SMT; Features: Moisture Resistant,Automotive AEC-Q200; Length: 0.039inch; Height: 0.015inch; Width: 0.02inch; Lead Free: Lead Free; ComponentLink1URL: https://datasheet.ciiva.com:443/pdfs/VipMasterIC/IC/YAGO/YAGO-S-A0003597364/YAGO-S-A0003597364-1.pdf?src-supplier=IHS+Markit; ComponentLink1Description: https://datasheet.ciiva.com:443/pdfs/VipMasterIC/IC/YAGO/YAGO-S-A0003597364/YAGO-S-A0003597364-1.pdf?src-supplier=IHS+Markit; ComponentLink2URL: http://www.mouser.com/ds/2/447/yageodocoutput-1111992.pdf?src-supplier=Mouser; ComponentLink2Description: http://www.mouser.com/ds/2/447/yageodocoutput-1111992.pdf?src-supplier=Mouser; ComponentLink3URL: http://www.yageo.com/NewPortal/yageodocoutput?fileName=/pdf/R-Chip/PYu-AC_51_RoHS_L_6.pdf&src-supplier=Digi-Key; ComponentLink3Description: http://www.yageo.com/NewPortal/yageodocoutput?fileName=/pdf/R-Chip/PYu-AC_51_RoHS_L_6.pdf&src-supplier=Digi-Key; ComponentLink4URL: http://www.yageo.com/documents/recent/PYu-AC_51_RoHS_L_2_revised.pdf?src-supplier=Future+Electronics; ComponentLink4Description: http://www.yageo.com/documents/recent/PYu-AC_51_RoHS_L_2_revised.pdf?src-supplier=Future+Electronics
TP1 = JUMPER: SHUNT LP W/HANDLE 2 POS 30AU; Manufacturer: TE Connectivity; Manufacturer Part Number: 8815452; Number of Contacts: 2; Contact Current Rating: 3A; Contact Resistance: 15mR; Gender: Female; Pitch: 2.54mm; Approvals: UL,CSA; Supplier 1: Digi-Key; Supplier Part Number 1: A26242-ND; RoHS: Yes; Category: Headers and Wire Housings; Stock 1: 2099; Pricing 1: 1=0.280000, 10=0.262000, 25=0.223600, 50=0.195600, 100=0.181700, 250=0.160760, 500=0.153760, 1000=0.125800, 2500=0.115320 (USD); Contact Plating: Gold; Housing Color: Black; Housing Material: Thermoplastic; Contact Material: Bronze; Color: Black; Min Operating Temperature: -65°C; Max Operating Temperature: 105°C; Number of Rows: 1; Package Quantity: 14000; Packaging: Bag; Orientation: Straight; Number of Positions: 2; Contact Gender: Female; Current Rating: 3A; Termination: Solder; Length: 5.08mm; Height: 10.9mm; Depth: 10.9mm; Width: 2.5mm; Radiation Hardening: No; Flammability Rating: UL94 V-0; REACH SVHC: No SVHC; ComponentLink1URL: https://datasheet.ciiva.com/1455/92946-1455888.pdf?src-supplier=Newark; ComponentLink1Description: https://datasheet.ciiva.com/1455/92946-1455888.pdf?src-supplier=Newark; ComponentLink2URL: https://datasheet.ciiva.com/19459/841467-19459897.pdf?src-supplier=Jameco; ComponentLink2Description: https://datasheet.ciiva.com/19459/841467-19459897.pdf?src-supplier=Jameco; ComponentLink3URL: https://datasheet.ciiva.com/15174/getdatasheetpartid-155768-15174939.pdf?src-supplier=Verical; ComponentLink3Description: https://datasheet.ciiva.com/15174/getdatasheetpartid-155768-15174939.pdf?src-supplier=Verical; ComponentLink4URL: https://datasheet.ciiva.com/11754/0900766b80da19e8-11754990.pdf?src-supplier=RSComponents; ComponentLink4Description: https://datasheet.ciiva.com/11754/0900766b80da19e8-11754990.pdf?src-supplier=RSComponents; ComponentLink5URL: https://datasheet.ciiva.com/30154/eng-cs-1307819-section-6-7and8-0808-30154293.pdf?src-supplier=Onlinecomponents.com; ComponentLink5Description: https://datasheet.ciiva.com/30154/eng-cs-1307819-section-6-7and8-0808-30154293.pdf?src-supplier=Onlinecomponents.com; ComponentLink6URL: https://datasheet.ciiva.com/767/eng-cd-881545-k3-767850.pdf?src-supplier=Digi-Key; ComponentLink6Description: https://datasheet.ciiva.com/767/eng-cd-881545-k3-767850.pdf?src-supplier=Digi-Key; ComponentLink7URL: https://datasheet.ciiva.com/3120/eng-cs-1307819-section-6-7and8-0808-3120202.pdf?src-supplier=Avnet; ComponentLink7Description: https://datasheet.ciiva.com/3120/eng-cs-1307819-section-6-7and8-0808-3120202.pdf?src-supplier=Avnet
U1 = NRSC-NRF52832-QF-48: Multiprotocol Bluetooth Smart, ANT/ANT+ and Proprietary System-on-Chip, 2.4 GHz, 256 KB FLASH, 1.7 to 3.6 V, -40 to 85 degC, 48-Pin QFN, RoHS, Tape and Reel; Manufacturer: Nordic Semiconductor; Interface: SPI,UART; Frequency: 2.4GHz; Data Rate: 2Mbps; Sensitivity: -96dBm; Memory Size: 64KB; Number of GPIO: 32; Current - Receiving: 5.4mA; Current - Transmitting: 7.5mA; Supplier 1: Digi-Key; Supplier Part Number 1: 1490-1067-1-ND; Manufacturer Part Number: NRF52832-QFAA-R7; RoHS: No; Category: RF Receivers, Transceivers; Stock 1: 7487; Pricing 1: 1=5.46000, 10=4.87500, 25=4.38760, 100=3.99750, 250=3.60752, 500=3.23700 (USD); Packaging: Tape and Reel; ComponentLink1URL: https://datasheet.ciiva.com:443/pdfs/VipMasterIC/IC/NRSA/NRSA-S-A0002414264/NRSA-S-A0002414264-1.pdf?src-supplier=IHS+Markit; ComponentLink1Description: https://datasheet.ciiva.com:443/pdfs/VipMasterIC/IC/NRSA/NRSA-S-A0002414264/NRSA-S-A0002414264-1.pdf?src-supplier=IHS+Markit; ComponentLink5URL: http://infocenter.nordicsemi.com/pdf/nRF52832_PB_v1.7.pdf?src-supplier=Digi-Key; ComponentLink5Description: http://infocenter.nordicsemi.com/pdf/nRF52832_PB_v1.7.pdf?src-supplier=Digi-Key; ComponentLink6URL: http://infocenter.nordicsemi.com/pdf/nRF52832_PS_v1.4.pdf?src-supplier=Digi-Key; ComponentLink6Description: http://infocenter.nordicsemi.com/pdf/nRF52832_PS_v1.4.pdf?src-supplier=Digi-Key
X1 = CRYSTAL_32MHz: Parallel - Fundamental Quartz Crystal, 32MHz Nom; Manufacturer: Diodes; Manufacturer Part Number: US3200005Z; Load Capacitance: 8pF; ESR (Equivalent Series Resistance): 80R; Frequency Stability: 10ppm; Supplier 1: Digi-Key; Supplier Part Number 1: US3200005ZCT-ND; RoHS: Yes; Category: Crystals; Pricing 1: 1=1.45000, 10=1.38400, 50=1.35200, 100=1.15880, 500=1.12666, 1000=0.94961 (USD); Mount: Surface Mount; Case/Package: SMD/SMT; Min Operating Temperature: -20°C; Max Operating Temperature: 70°C; Packaging: Tape and Reel; Frequency: 32MHz; Frequency Tolerance: 10ppm; Length: 0.063inch; Height: 0.014inch; Width: 0.047inch; ComponentLink1URL: https://datasheet.ciiva.com:443/pdfs/VipMasterIC/IC/DIOD/DIOD-S-A0002236499/DIOD-S-A0002236499-1.pdf?src-supplier=IHS+Markit; ComponentLink1Description: https://datasheet.ciiva.com:443/pdfs/VipMasterIC/IC/DIOD/DIOD-S-A0002236499/DIOD-S-A0002236499-1.pdf?src-supplier=IHS+Markit; ComponentLink2URL: https://media.digikey.com/pdf/Data%20Sheets/Pericom%20PDFs/US3200005Z_Ver.A.pdf?src-supplier=Digi-Key; ComponentLink2Description: https://media.digikey.com/pdf/Data%20Sheets/Pericom%20PDFs/US3200005Z_Ver.A.pdf?src-supplier=Digi-Key
X2 = CRYSTAL_32K768: Parallel - Fundamental Quartz Crystal, 0.032768MHz Nom; Manufacturer: ECS International; Manufacturer Part Number: ECS-.327-9-1210-TR; Frequency Tolerance: 20ppm; Load Capacitance: 9pF; ESR (Equivalent Series Resistance): 90kR; Supplier 1: Digi-Key; Supplier Part Number 1: XC2283CT-ND; RoHS: No; Category: Crystals and Oscillators; Stock 1: 5205; Pricing 1: 1=1.52000, 10=1.45400, 50=1.42060, 100=1.21770, 500=1.18388, 1000=0.99784, 2500=0.94710 (USD); Mount: Surface Mount; Case/Package: SMD/SMT; Min Operating Temperature: -40°C; Max Operating Temperature: 85°C; Packaging: Tape and Reel; Frequency: 32.768kHz; ComponentLink1URL: https://datasheet.ciiva.com:443/pdfs/VipMasterIC/IC/ECSI/ECSI-S-A0009254912/ECSI-S-A0009254912-1.pdf?src-supplier=IHS+Markit; ComponentLink1Description: https://datasheet.ciiva.com:443/pdfs/VipMasterIC/IC/ECSI/ECSI-S-A0009254912/ECSI-S-A0009254912-1.pdf?src-supplier=IHS+Markit; ComponentLink2URL: https://www.ecsxtal.com/store/pdf/ECX-1210.pdf?src-supplier=Digi-Key; ComponentLink2Description: https://www.ecsxtal.com/store/pdf/ECX-1210.pdf?src-supplier=Digi-Key